# EAGLE design contactorcontactor (EAGLE 9.5.1)
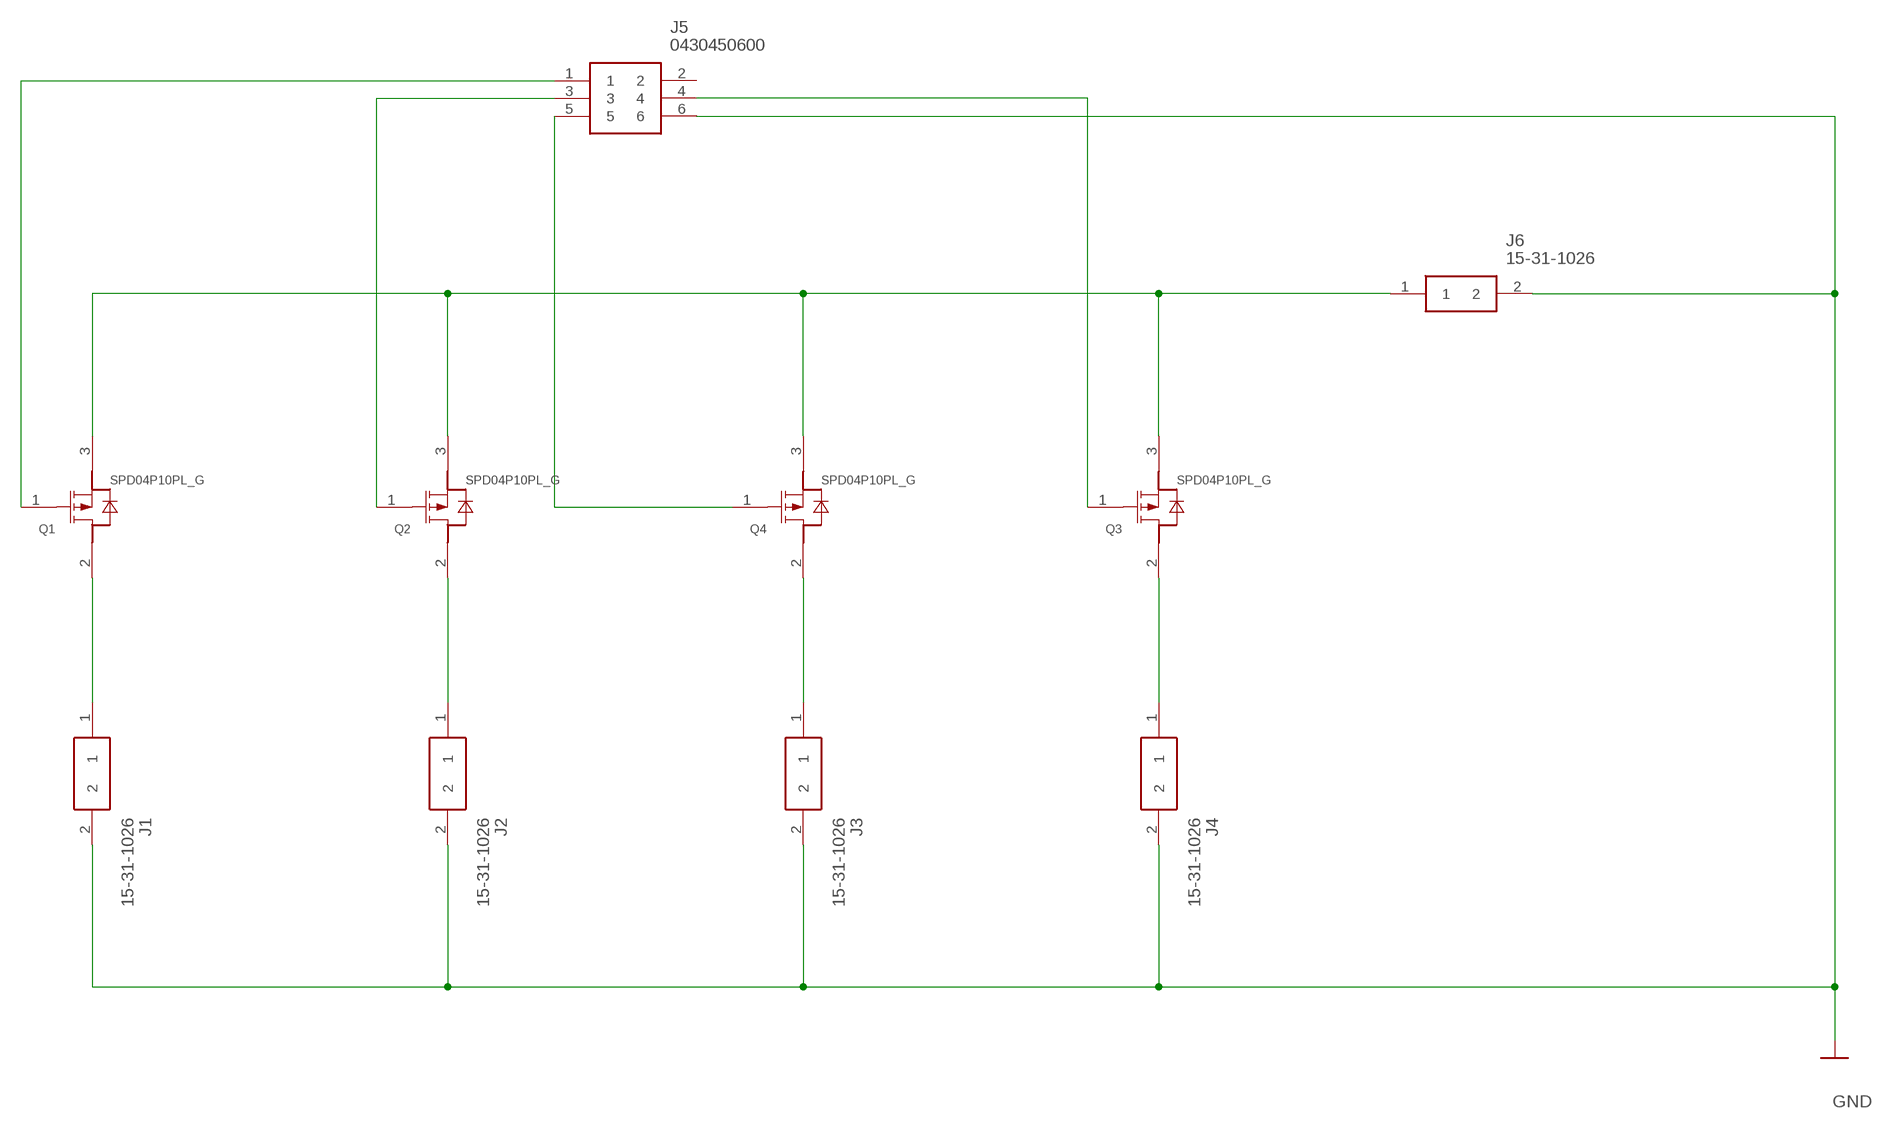
[diagram p0: schematic, sheet 1]

## Parts
J1  15-31-1026  [15311026]
J2  15-31-1026  [15311026]
J3  15-31-1026  [15311026]
J4  15-31-1026  [15311026]
J5  0430450600  [0430450601]
J6  15-31-1026  [15311026]
Q1  SPD04P10PL_G  [TO229P994X241-3N]
Q2  SPD04P10PL_G  [TO229P994X241-3N]
Q3  SPD04P10PL_G  [TO229P994X241-3N]
Q4  SPD04P10PL_G  [TO229P994X241-3N]

## Nets
ASDF: J5.1 Q1.1
GND: J1.2 J2.2 J3.2 J4.2 J5.6 J6.2
N$1: J2.1 Q2.2
N$2: J3.1 Q4.2
N$3: J4.1 Q3.2
N$4: J1.1 Q1.2
N$5: J6.1 Q1.3 Q2.3 Q3.3 Q4.3
N$6: J5.5 Q4.1
N$7: J5.3 Q2.1
N$9: J5.4 Q3.1
Unconnected: J5.2

## Library data of the parts
J1-J4 J6 = 15-31-1026:15-31-1026: Molex STANDARD .093 Series, Series Number 5025, 6.7mm Pitch 2 Way 1 Row Straight PCB Header, Solder Termination, 12A Source: Datasheet <https://www.molex.com/molex/products/datasheet.jsp?part=active/0015311026_PCB_HEADERS.xml>; DESCRIPTION: Molex STANDARD .093 Series, Series Number 5025, 6.7mm Pitch 2 Way 1 Row Straight PCB Header, Solder Termination, 12A; HEIGHT: 15mm; MANUFACTURER_NAME: Molex; MANUFACTURER_PART_NUMBER: 15-31-1026; MOUSER_PART_NUMBER: 538-15-31-1026; MOUSER_PRICE-STOCK: https://www.mouser.com/Search/Refine.aspx?Keyword=538-15-31-1026; RS_PART_NUMBER: 6700289; RS_PRICE-STOCK: https://uk.rs-online.com/web/p/products/6700289
J5 = SamacSys_Parts:0430450600: Micro-Fit 3.0 Right Angle Header, 3.00mm Pitch, Dual Row, 6 Circuits, with Snap-in Plastic Peg PCB Lock, Tin, Glow Wire Capable, Black Source: Datasheet <http://www.molex.com/pdm_docs/sd/430450600_sd.pdf>; DESCRIPTION: Micro-Fit 3.0 Right Angle Header, 3.00mm Pitch, Dual Row, 6 Circuits, with Snap-in Plastic Peg PCB Lock, Tin, Glow Wire Capable, Black; HEIGHT: mm; MANUFACTURER_NAME: Molex; MANUFACTURER_PART_NUMBER: 0430450600; MOUSER_PART_NUMBER: N/A; MOUSER_PRICE-STOCK: https://www.mouser.com/Search/Refine.aspx?Keyword=N%2FA
Q1-Q4 = SPD04P10PL G:SPD04P10PL_G: SPD04P10PL G SIPMOS Power-Transistor -100V TO229P994X241-3N

## Board
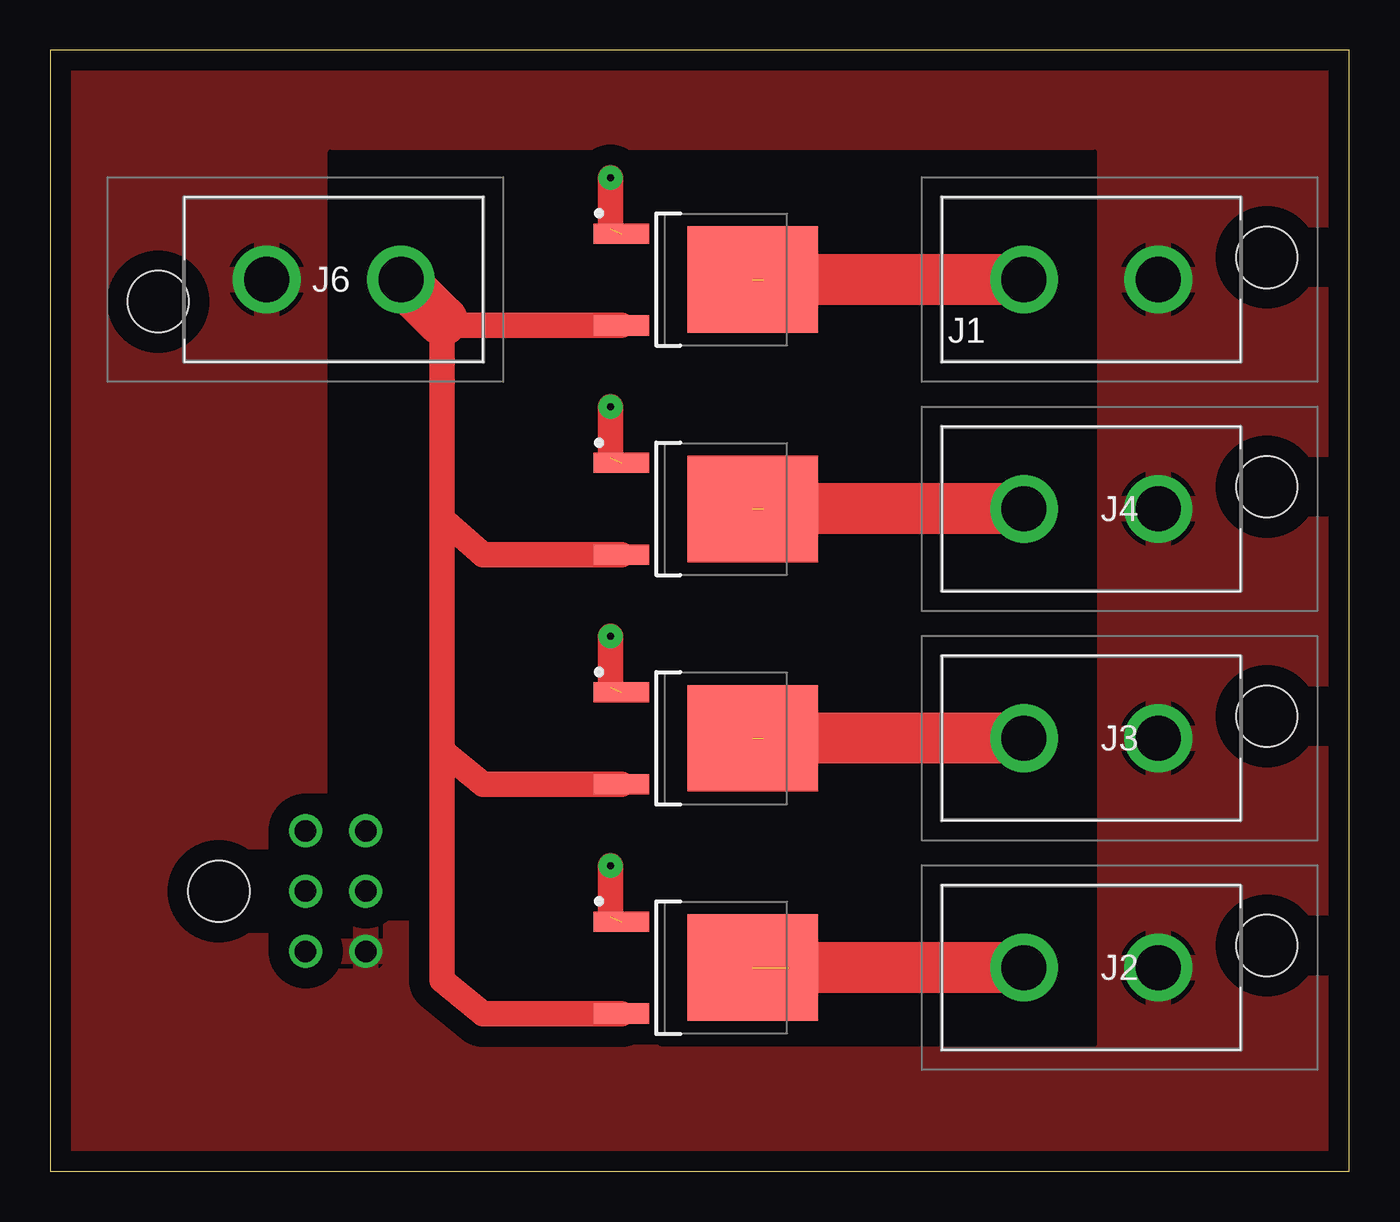
[diagram p1: board, top side]
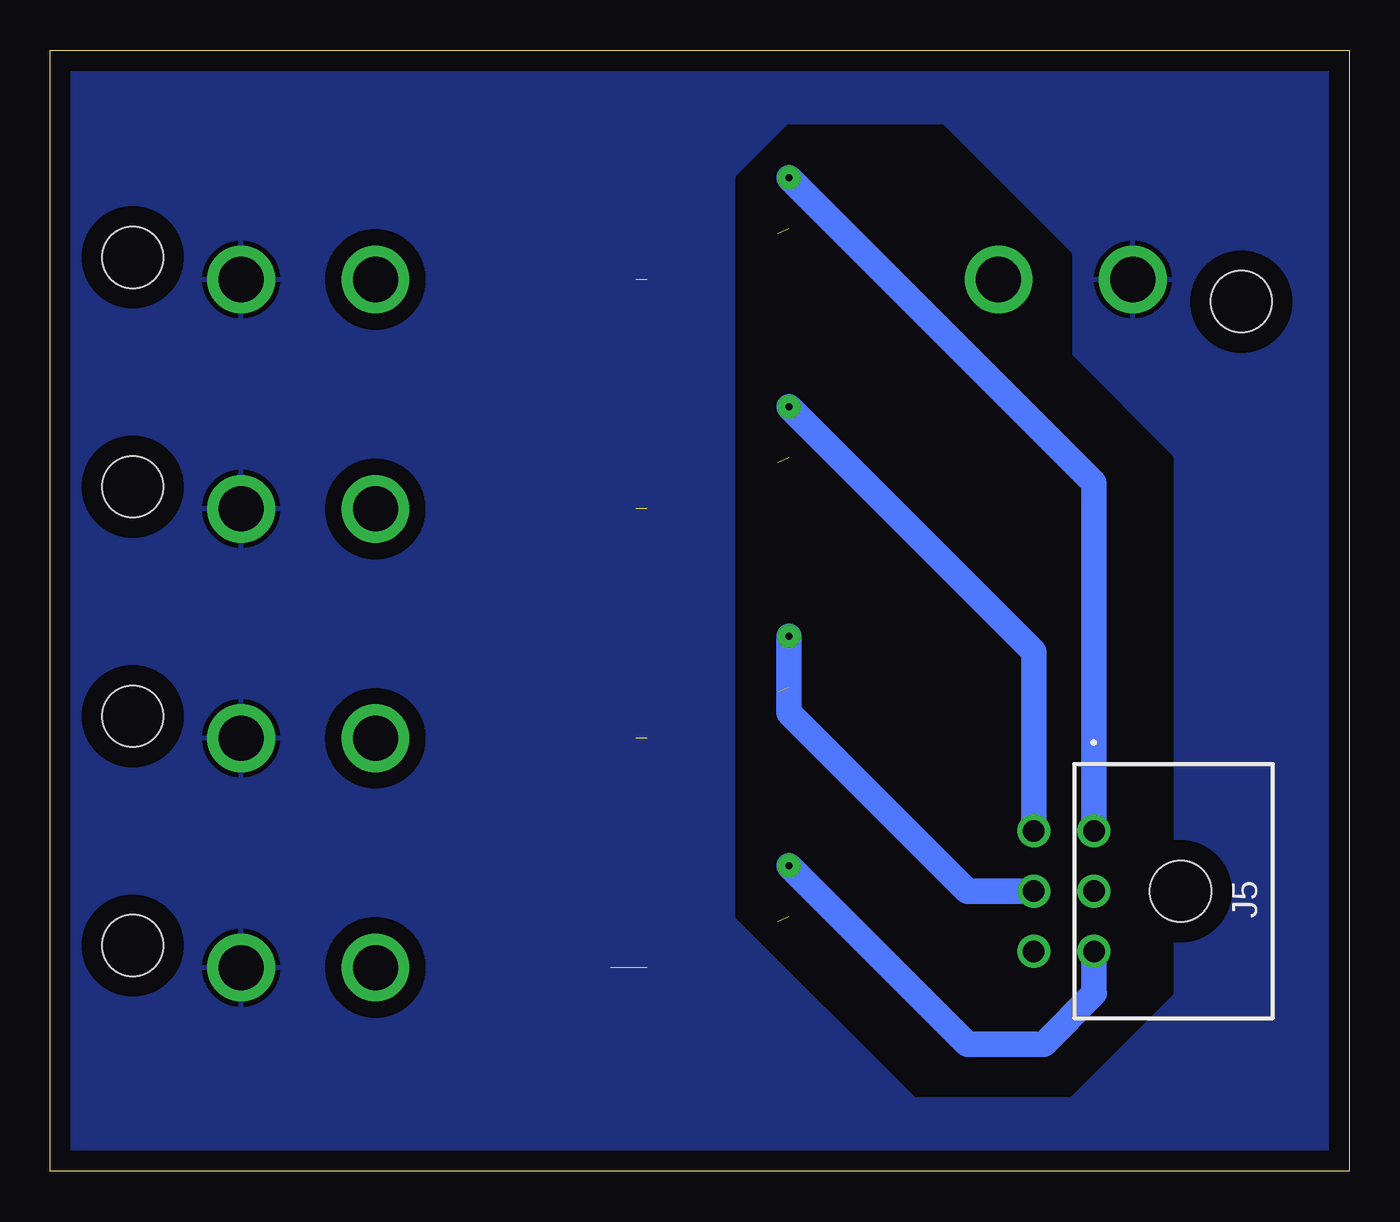
[diagram p2: board, bottom side, seen from below]

Size 64.77 x 55.88 mm. Coordinates in mm from the lower left corner, seen from the top.
Outline: 0,0 64.77,0 64.77,55.88 0,55.88 0,0
Copper layers (1*16): Top 0.035mm / dielectric 1.5mm / Bottom 0.035mm
Design rules "default *": minimum track width 6mil, minimum drill 0.35mm, track to track 12mil, track to pad 12mil, pad to pad 12mil, via to via 12mil, smd to smd 6mil, copper to edge 40mil, drill to drill 6mil, minimum pad ring 10mil, minimum via ring 8mil, stop-mask expansion 4mil, vias tented up to drill 0mil, thermal gap 10mil

### Footprints (pad centres in the part's own frame; a part is rotated, then mirrored left to right if it is on the bottom)
15311026 = drill 2.25 pad 3.375: 1 4.1,0; 2 10.8,0 | hole 3.05: 16.2,1.1
0430450601 = drill 1.07 pad 1.65: 1 3,8.92; 2 0,8.92; 3 -3,8.92; 4 3,11.92; 5 0,11.92; 6 -3,11.92 | hole 3.05: 0,4.6
TO229P994X241-3N = smd 2.75 x 1: 1 -3.275,2.29; 3 -3.275,-2.29 | smd 6.5 x 5.3: 2 3.275,0

### Placement (x,y rotation side)
J1  44.45,44.45 0 top
J2  44.45,10.16 0 top
J3  44.45,21.59 0 top
J4  44.45,33.02 0 top
J5  3.81,13.97 90 bottom
J6  21.59,44.45 180 top
Q1  31.75,44.45 0 top
Q2  31.75,10.16 0 top
Q3  31.75,33.02 0 top
Q4  31.75,21.59 0 top

### Tracks (layer width: path | path; a pad name or v marks a point on that pad's centre or on a via)
ASDF  (via drill 0.35 pad 1.2)  (1 unrouted)
  Top 1.27: v27.94,49.53 27.94,46.99
  Bottom 1.27: J5.1 12.73,34.32 v27.94,49.53
GND
  pour Top (isolate 1.016, rank 2): 0,55.88 0,0 64.77,0 64.77,55.88
  pour Bottom (isolate 0.813): 0,55.88 64.77,55.88 64.77,0 0,0
N$1  (1 unrouted)
  Top 2.54: J2.1 36.83,10.16
N$2  (1 unrouted)
  Top 2.54: J3.1 35.56,21.59
N$3  (1 unrouted)
  Top 2.54: J4.1 35.56,33.02
N$4  (1 unrouted)
  Top 2.54: J1.1 35.56,44.45
N$5
  Top 1.27: Q1.3 19.78,42.16 19.54,42.4 19.54,32.53 | 19.54,32.53 21.59,30.73 Q3.3 | 19.54,32.53 19.54,20.95 | 19.54,20.95 21.59,19.3 Q4.3 | 19.54,20.95 19.54,9.52 21.59,7.87 Q2.3
  Top 2.54: J6.1 19.54,42.4
N$6  (via drill 0.35 pad 1.2)  (1 unrouted)
  Top 1.27: v27.94,26.67 27.94,24.13
  Bottom 1.27: J5.5 19.05,13.97 27.94,22.86 v27.94,26.67
N$7  (via drill 0.35 pad 1.2)  (1 unrouted)
  Top 1.27: v27.94,15.24 27.94,12.7
  Bottom 1.27: J5.3 12.73,8.92 12.7,8.89 15.24,6.35 19.05,6.35 v27.94,15.24
N$9  (via drill 0.35 pad 1.2)  (1 unrouted)
  Top 1.27: v27.94,38.1 27.94,35.56
  Bottom 1.27: v27.94,38.1 15.73,25.89 J5.4
NON-GND
  cutout Top: 52.07,6.35 30.48,6.35 20.32,16.51 13.97,16.51 13.97,50.8 52.07,50.8
  cutout Bottom: 27.94,52.07 20.32,52.07 15.24,46.99 13.97,45.72 13.97,41.91 13.97,40.64 8.89,35.56 8.89,8.89 13.97,3.81 21.59,3.81 30.48,12.7 30.48,48.26 30.48,49.53